# Altium project sound_bar.PrjPcb
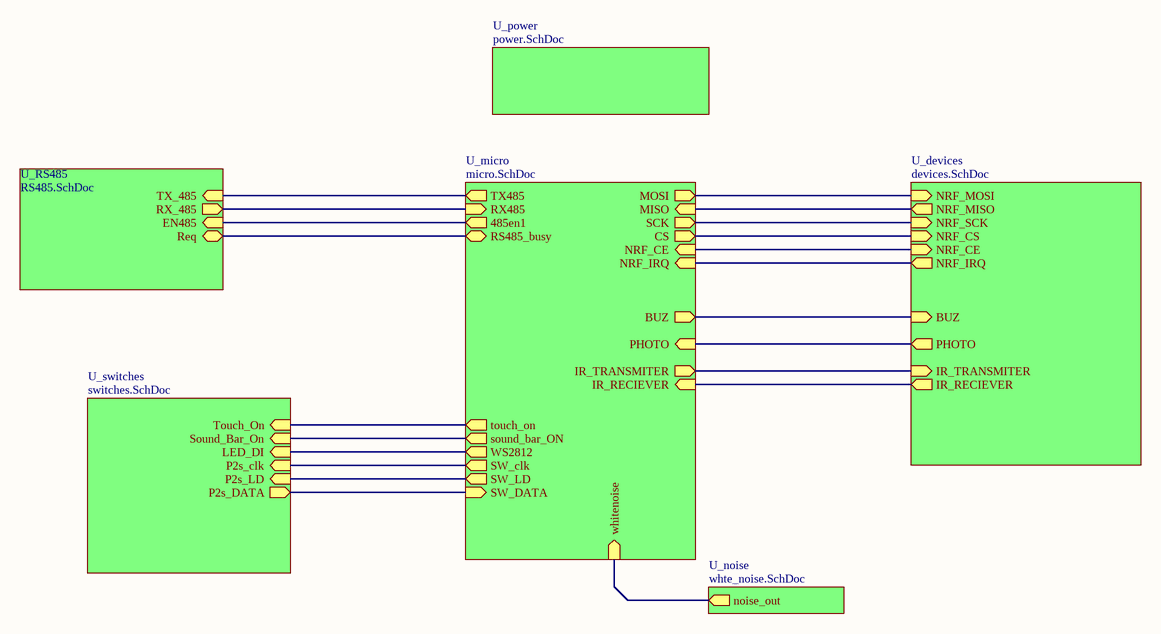
[diagram p0: top.SchDoc]
9 sheets, 289 parts. Net scope: hierarchical (ports join the sheet entries above them; power ports are global).
Board file: SOUNDBAR.PcbDoc
Sheets:
  top.SchDoc
    U_noise = whte_noise.SchDoc
    U_power = power.SchDoc
    U_RS485 = RS485.SchDoc
    U_switches = switches.SchDoc
      U_indicators = indicators.SchDoc
        L1 = led_pack12_touch.SchDoc
        L2 = led_pack12_touch.SchDoc
        L3 = led_pack12_touch.SchDoc
        L4 = led_pack12_touch.SchDoc
        L5 = led_pack12_touch.SchDoc
        L6 = led_pack12_touch.SchDoc
        L7 = led_pack12_touch.SchDoc
        L8 = led_pack12_touch.SchDoc
        L9 = led_pack12_touch.SchDoc
        L10 = led_pack12_touch.SchDoc
        L11 = led_pack12_touch.SchDoc
        L12 = led_pack12_touch.SchDoc
        L13 = led_pack12_touch.SchDoc
        L14 = led_pack12_touch.SchDoc
        L15 = led_pack12_touch.SchDoc
        L16 = led_pack12_touch.SchDoc
        L17 = led_pack12_touch.SchDoc
        L18 = led_pack12_touch.SchDoc
    U_micro = micro.SchDoc
    U_devices = devices.SchDoc

## Sheet top.SchDoc
size A4

### Sub-sheets
U_devices = devices.SchDoc: NRF_MISO (out), NRF_SCK (in), NRF_CE (in), NRF_IRQ (out), NRF_CS (in), NRF_MOSI (in), BUZ (in), PHOTO (out), IR_RECIEVER (out), IR_TRANSMITER (in)
U_micro = micro.SchDoc: whitenoise (in), RX485 (in), TX485 (out), 485en1 (out), RS485_busy (bidir), PHOTO (in), NRF_CE (in), WS2812 (out), NRF_IRQ (in), touch_on (out), IR_RECIEVER (in), IR_TRANSMITER (out), sound_bar_ON (out), MOSI (out), MISO (in), SCK (out), CS (out), BUZ (out), SW_DATA (in), SW_clk (out), SW_LD (out)
U_noise = whte_noise.SchDoc: noise_out (out)
U_power = power.SchDoc: no entries
U_RS485 = RS485.SchDoc: RX_485 (out), EN485 (in), TX_485 (in), Req (bidir)
U_switches = switches.SchDoc: P2s_clk (in), P2s_LD (in), P2s_DATA (out), LED_DI (in), Sound_Bar_On (in), Touch_On (in)

### Nets
485en: sheet U_RS485/EN485, sheet U_micro/485en1
CS: sheet U_micro/CS, sheet U_devices/NRF_CS
IR_IN: sheet U_micro/IR_RECIEVER, sheet U_devices/IR_RECIEVER
IR_OUT: sheet U_micro/IR_TRANSMITER, sheet U_devices/IR_TRANSMITER
MISO: sheet U_micro/MISO, sheet U_devices/NRF_MISO
MOSI: sheet U_micro/MOSI, sheet U_devices/NRF_MOSI
PACK12_DI2: sheet U_switches/LED_DI, sheet U_micro/WS2812
photo: sheet U_micro/PHOTO, sheet U_devices/PHOTO
RS48_busy: sheet U_RS485/Req, sheet U_micro/RS485_busy
RX485: sheet U_RS485/RX_485, sheet U_micro/RX485
SCK: sheet U_micro/SCK, sheet U_devices/NRF_SCK
SNB-ON: sheet U_switches/Sound_Bar_On, sheet U_micro/sound_bar_ON
SW_clk: sheet U_switches/P2s_clk, sheet U_micro/SW_clk
SW_DATA: sheet U_switches/P2s_DATA, sheet U_micro/SW_DATA
SW_LD: sheet U_switches/P2s_LD, sheet U_micro/SW_LD
TX485: sheet U_RS485/TX_485, sheet U_micro/TX485
whitenoise: sheet U_noise/noise_out, sheet U_micro/whitenoise
NetNRF1_3: sheet U_micro/NRF_CE, sheet U_devices/NRF_CE
NetNRF1_8: sheet U_micro/NRF_IRQ, sheet U_devices/NRF_IRQ
NetSP1_1: sheet U_micro/BUZ, sheet U_devices/BUZ
NetU1_27: sheet U_switches/Touch_On, sheet U_micro/touch_on

## Sheet whte_noise.SchDoc
size A4
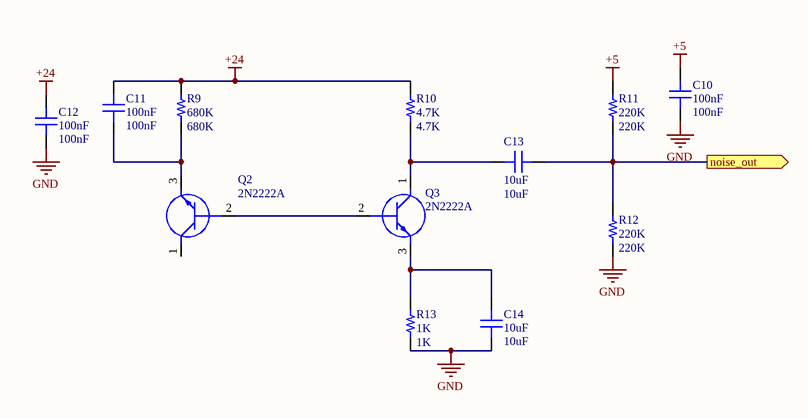
[diagram p1: whte_noise.SchDoc]

### Parts
C10  100nF  [cap805]
C11  100nF  [cap805]
C12  100nF  [cap805]
C13  10uF  [cap805]
C14  10uF  [cap805]
Q2  2N2222A  [soT95p280x130-3n]
Q3  2N2222A  [soT95p280x130-3n]
R9  680K  [0603R]
R10  4.7K  [0603R]
R11  220K  [0603R]
R12  220K  [0603R]
R13  1K  [0603R]

### Ports
noise_out (out)

### Nets
+5: C10.1 R11.2
+24: C11.2 C12.1 R9.2 R10.2
GND: C10.2 C12.2 C14.1 R12.1 R13.1
whitenoise: C13.1 R11.1 R12.2 ; port noise_out
NetC11_1: C11.1 Q2.3(E) R9.1
NetC13_2: C13.2 Q3.1(C) R10.1
NetC14_2: C14.2 Q3.3(E) R13.2
NetQ2_2: Q2.2(B) Q3.2(B)

Not connected (* = marked no-connect by the designer): Q2 1(C)

### Library data of the parts
C10-C14 = Capacitor: CAP SMD 0805; Part Number: C0805X106K9RAC7800
  C10-C12: Value: 100nF
  C13 C14: Value: 10uF
Q2 Q3 = 2N2222A: Transistor BJT NPN SMD; pin to pad: 1>3 2>1 3>2; Manufacturer_Name: Foshan Blue Rocket Elec; Datasheet Link: https://datasheet.lcsc.com/szlcsc/1901291437_Foshan-Blue-Rocket-Elec-2N2222A_C358533.pdf; Height: 4.7mm; Manufacturer_Part_Number: 2N2222A
R9-R13 = Resistor: RES SMD 0603; Part Number: RCS0805100KFKEA
  R9: Value: 680K
  R10: Value: 4.7K
  R11 R12: Value: 220K
  R13: Value: 1K

## Sheet power.SchDoc
size A4
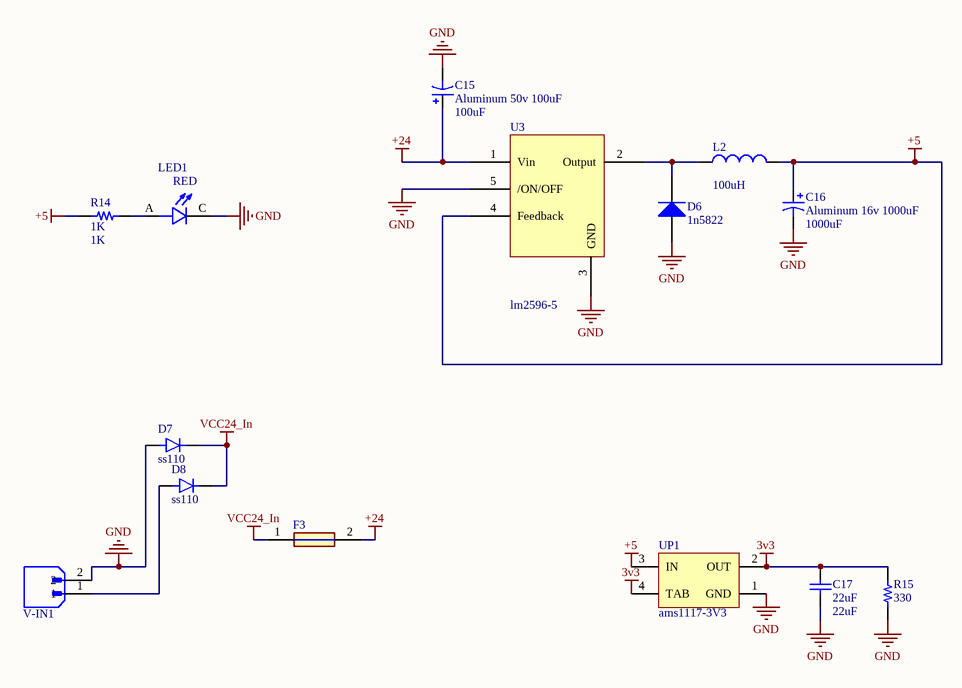
[diagram p2: power.SchDoc]

### Parts
C15  Aluminum 50v 100uF  value 100uF  [Cap SMD 100UF 35~50v]
C16  Aluminum 16v 1000uF  value 1000uF  [CAP SMD 1000UF 16V]
C17  22uF  [0603C]
D6  1n5822  [SMA DIODE 2]
D7  ss110  [ss110]
D8  ss110  [ss110]
F3  fuse 2amp  [1206 FUSE]  (value not drawn)
L2  value 100uH  [inductor]  (hidden comment: inductor 100uH)
LED1  LED RED  [LED_7012X1]  (value not drawn)
R14  1K  [0603R]
R15  330  [0603R]
U3  lm2596-5  [2596]
UP1  ams1117-3V3  [SOT223]
V-IN1  Phoenix  [AMPHENOL_OQ0271510000G]  (value not drawn)

### Nets
3v3: C17.2 R15.1 UP1.2(OUT) UP1.4(TAB)
+5: C16.1 L2.2 R14.1 U3.4(Feedback) UP1.3(IN)
+24: C15.1 F3.2 U3.1(Vin)
GND: C15.2 C16.2 C17.1 D6.1(A) D7.A LED1.C R15.2 U3.3(GND) U3.5(/ON/OFF) UP1.1(GND) V-IN1.2
VCC24_In: D7.C(K) D8.C(K) F3.1
NetD6_2: D6.2(K) L2.1 U3.2(Output)
NetD8_A: D8.A V-IN1.1
NetLED1_A: LED1.A R14.2

### Notes on the sheet
- (in symbol 7012X1) RED

### Library data of the parts
C15 C16 = Cap Pol1: CAP POLAR SMD; Published: 8-Jun-2000; LatestRevisionDate: 17-Jul-2002; LatestRevisionNote: Re-released for DXP Platform.; PackageReference: RB7.6-15; Publisher: Altium Limited; PackageDescription: Polarized Capacitor (Radial); 2 Leads
C17 = Cap: CAP SMD 0603; Published: 8-Jun-2000; LatestRevisionDate: 17-Jul-2002; LatestRevisionNote: Re-released for DXP Platform.; PackageReference: RAD-0.3; Publisher: Altium Limited; PackageDescription: Radial Cap, Thru-Hole; 2 Leads; 0.3 in Pin Spacing; Value: 22uF
D6 = Diode 1N4007: 1 Amp schottky Diode SMA; Published: 8-Jun-2000; LatestRevisionDate: 17-Jul-2002; LatestRevisionNote: Re-released for DXP Platform.; DatasheetVersion: 1998; PackageVersion: Aug-1999; PackageReference: DO-41; Publisher: Altium Limited; PackageDescription: Diode, Axial; Body 5.2 x 2.7 mm (LxDia. max), Lead Dia. 0.86 mm (max); Code_JEDEC: DO-204-AL; ComponentLink1Description: Manufacturer Link; ComponentLink1URL: http://www.fairchildsemi.com/; ComponentLink2Description: Datasheet; ComponentLink2URL: http://www.fairchildsemi.com/ds/1N%2F1N4001.pdf
D7 D8 = SBR0560S1-7: Diode Super Barrier 60V 500mA Surface Mount SOD-123; MF: Diodes Inc.; MP: SBR0560S1-7; Availability: Unavailable; SnapEDA_Link: https://www.snapeda.com/parts/SBR0560S1-7/Diodes%20Inc./view-part/491648/?ref=snap; Package: SOD-123 Diodes Inc.; Value: *; Price: None
F3 = 1206SFS200F_63-2: Fuse 1206; Manufacturer_Name: TE Connectivity; Manufacturer_Part_Number: 1206SFS200F/63-2; Datasheet Link: http://docs-emea.rs-online.com/webdocs/13b6/0900766b813b6e27.pdf; Height: 1.17mm
L2 = Inductor: Inductor 12*12mm; Code_IEC: 1005; Published: 8-Jun-2000; LatestRevisionDate: 29-May-2009; LatestRevisionNote: IPC-7351 Footprint Added.; PackageReference: 0402-A; Publisher: Altium Limited; PackageDescription: Chip Inductor; Code_JEITA: 0402
LED1 = 7012X1: LED SMD 0805 RED; Package: None; Price: None; Value: *; MP: 7012X1; Availability: Unavailable
R14 R15 = Resistor: as R9 on sheet whte_noise
  R14: Value: 1K
  R15: Value: 330
U3 = lm2596
UP1 = AMS1117-x.x: 3.3 Volt, 800mA SOT-223; Designer: Ali Hafizi; Data: 16-12-2016
V-IN1 = OQ0271510000G: Phoenix Terminal Right 2PIN; MF: Amphenol Anytek; MP: OQ0271510000G; Value: *; Check_prices: https://www.snapeda.com/parts/OQ0271510000G/Amphenol/view-part/4075971/?ref=eda; SnapEDA_Link: https://www.snapeda.com/parts/OQ0271510000G/Amphenol/view-part/4075971/?ref=snap; Price: None; Availability: Warning; Purchase-URL: https://pricing.snapeda.com/search/part/OQ0271510000G/?ref=eda; Package: None

## Sheet RS485.SchDoc
size A4
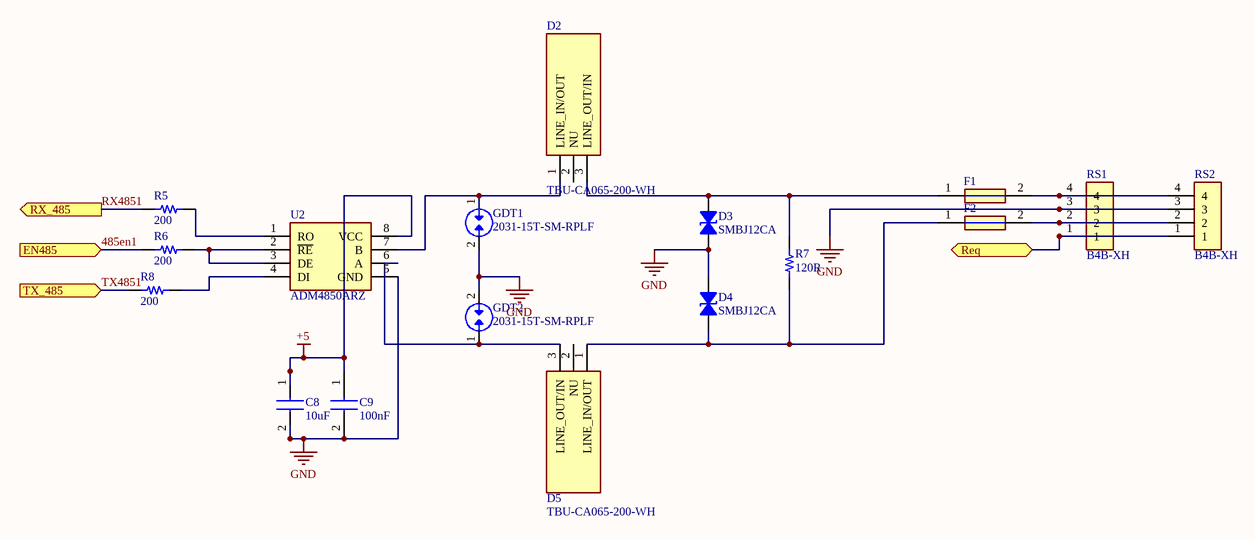
[diagram p3: RS485.SchDoc]

### Parts
C8  10uF  [Cap1206_(3216X15L)]
C9  100nF  [Cap1206_(3216X15L)]
D2  TBU-CA065-200-WH  [TBUCA025050WH]
D3  SMBJ12CA  [DO214AA SMB]
D4  SMBJ12CA  [DO214AA SMB]
D5  TBU-CA065-200-WH  [TBUCA025050WH]
F1  fuse 100mAmp  [1206 FUSE]  (value not drawn)
F2  fuse 100mAmp  [1206 FUSE]  (value not drawn)
GDT1  2031-15T-SM-RPLF  [TVS_2031-15T-SM-RPLF]
GDT2  2031-15T-SM-RPLF  [TVS_2031-15T-SM-RPLF]
R5  200  [0603R]
R6  200  [0603R]
R7  120R  [0603R]
R8  200  [0603R]
RS1  B4B-XH  [JST-B4B-XH]
RS2  B4B-XH  [JST-B4B-XH]
U2  ADM4850ARZ  [SO8_N]

### Ports
EN485 (in), Req (bidir), RX_485 (out), TX_485 (in)

### Nets
+5: C8.1 C9.1 U2.8(VCC)
GND: C8.2 C9.2 D3.1 D4.2 GDT1.2 GDT2.2 RS1.3 RS2.3 U2.5(GND)
485en1: R6.2 ; port EN485  [project net 485en]
RS48_busy: RS1.1 RS2.1 ; port Req
RX4851: R5.2 ; port RX_485  [project net RX485]
TX4851: R8.2 ; port TX_485  [project net TX485]
NetD2_1: D2.1(LINE_IN/OUT) GDT1.1 U2.7(B)
NetD2_3: D2.3(LINE_OUT/IN) D3.2 F1.1 R7.1
NetD4_1: D4.1 D5.1(LINE_IN/OUT) F2.1 R7.2
NetD5_3: D5.3(LINE_OUT/IN) GDT2.1 U2.6(A)
NetF1_2: F1.2 RS1.4 RS2.4
NetF2_2: F2.2 RS1.2 RS2.2
NetR5_1: R5.1 U2.1(RO)
NetR6_1: R6.1 U2.2(~{RE}) U2.3(DE)
NetR8_1: R8.1 U2.4(DI)

Not connected (* = marked no-connect by the designer): D2 2(NU); D5 2(NU)

### Library data of the parts
C8 C9 = C1206C104Z5UACTU: CAP SMD 0603; Manufacturer_Name: Kemet; Datasheet Link: https://componentsearchengine.com/Datasheets/1/C1206C104Z5UACTU.pdf; Height: 0.88mm; Manufacturer_Part_Number: C1206C104Z5UACTU; Mouser Part Number: 80-C1206C104Z5U; Mouser Price/Stock: https://www.mouser.com/Search/Refine.aspx?Keyword=80-C1206C104Z5U
D2 D5 = TBU-CA065-200-WH: TVS Diode (Bi-directional); Manufacturer_Name: Bourns; Datasheet Link: https://www.bourns.com/data/global/pdfs/TBU-CA.pdf; Height: 1mm; Manufacturer_Part_Number: TBU-CA065-200-WH; Mouser Part Number: 652-TBU-CA065-200-WH; Mouser Price/Stock: https://www.mouser.co.uk/ProductDetail/Bourns/TBU-CA065-200-WH?qs=kLtMOTa49OkdVs42fYbv8A%3D%3D; Arrow Part Number: TBU-CA065-200-WH; Arrow Price/Stock: https://www.arrow.com/en/products/tbu-ca065-200-wh/bourns?region=nac
D3 D4 = SMBJ12CA: TVS DIODE 12V 19.9V SMB; Manufacturer: AVX Corporation; Bidirectional Channels: 1; Current - Peak Pulse (10/1000µs): 30.15A; Power Line Protection: No; Power - Peak Pulse: 600W; Type: Zener; Voltage - Breakdown (Min): 13.3V; Part Number: SMBJ12CA; Applications: General Purpose; ComponentLink1Description: Datasheet; ComponentLink1URL: //media.digikey.com/pdf/Data%20Sheets/AVX%20PDFs/Transient%20Suppression%20Diodes.pdf; ComponentLink2Description: DigiKey Link; ComponentLink2URL: http://digikey.com/product-detail/en/avx-corporation/SMBJ12CA/478-7062-1-ND/3340353; LastUpdated: 9/2/2020 1:28:17 AM; Lifecycle Status: Active; Minimum Order: 1; Mounting Type: Surface Mount; Operating Temperature: -55°C ~ 150°C (TJ); Package / Case: DO-214AA, SMB; Packaging: TapeAndReel; PartId: 9012; Part Status: Active; Price: 0.16; Series: -; Supplier 1: DigiKey; Supplier Part Number 1: 478-7062-1-ND; Supplier Device Package: SMB; Voltage - Clamping (Max) @ Ipp: 19.9V; Voltage - Reverse Standoff (Typ): 12V
F1 F2 = 1206SFS200F_63-2: as F3 on sheet power; Datasheet Link: http://docs-emea.rs-online.com/webdocs/13b6/0900766b813b6e27.pdf; Height: 1.17mm
GDT1 GDT2 = 2031-15T-SM-RPLF: Gas Discharge Tube SMD; Package: None; Price: None; Value: *; MP: 2031-15T-SM-RPLF; Availability: Unavailable
R5-R8 = CRCW080510K0JNEAIF: RES SMD 0603; Manufacturer: Vishay Dale; Power (Watts): 0.125W, 1/8W; Resistance: 10 kOhms; Temperature Coefficient: ±200ppm/°C; Tolerance: ±5%; Part Number: CRCW080510K0JNEAIF; ComponentLink1Description: Datasheet; ComponentLink1URL: http://www.vishay.com/docs/20024/dcrcwife3.pdf; ComponentLink2Description: DigiKey Link; ComponentLink2URL: http://digikey.com/product-detail/en/vishay-dale/CRCW080510K0JNEAIF/541-10KAPCT-ND/3477322; Composition: Thick Film; Device Package: 0805 (2012 Metric); Features: Automotive AEC-Q200, Pulse Withstanding; Height - Seated (Max): 0.020" (0.50mm); LastUpdated: 9/2/2020 1:14:55 AM; Lifecycle Status: Active; Minimum Order: 1; Number of Terminations: 2; Operating Temperature: -55°C ~ 155°C; Package / Case: 0805 (2012 Metric); Packaging: TapeAndReel; PartId: 40891; Part Status: Active; Price: 0.08; Ratings: AEC-Q200; Series: CRCW-IF; Size / Dimension: 0.079" L x 0.049" W (2.00mm x 1.25mm); Supplier 1: DigiKey; Supplier Part Number 1: 541-10KAPCT-ND; Supplier Device Package: 0805
  R5 R6 R8: Value: 200
  R7: Value: 120R
RS1 RS2 = B4B-XH: XH 4pin standing
U2 = ADM4850ARZ: MAX485 SMD; Manufacturer_Name: Analog Devices; Datasheet Link: http://www.analog.com/static/imported-files/data_sheets/ADM4850_4851_4852_4853_4854_4855_4856_4857.pdf; Height: 1.75mm; Manufacturer_Part_Number: ADM4850ARZ; Mouser Part Number: 584-ADM4850ARZ; Mouser Price/Stock: https://www.mouser.com/Search/Refine.aspx?Keyword=584-ADM4850ARZ; Arrow Part Number: ADM4850ARZ; Arrow Price/Stock: https://www.arrow.com/en/products/adm4850arz/analog-devices

## Sheet switches.SchDoc
size A
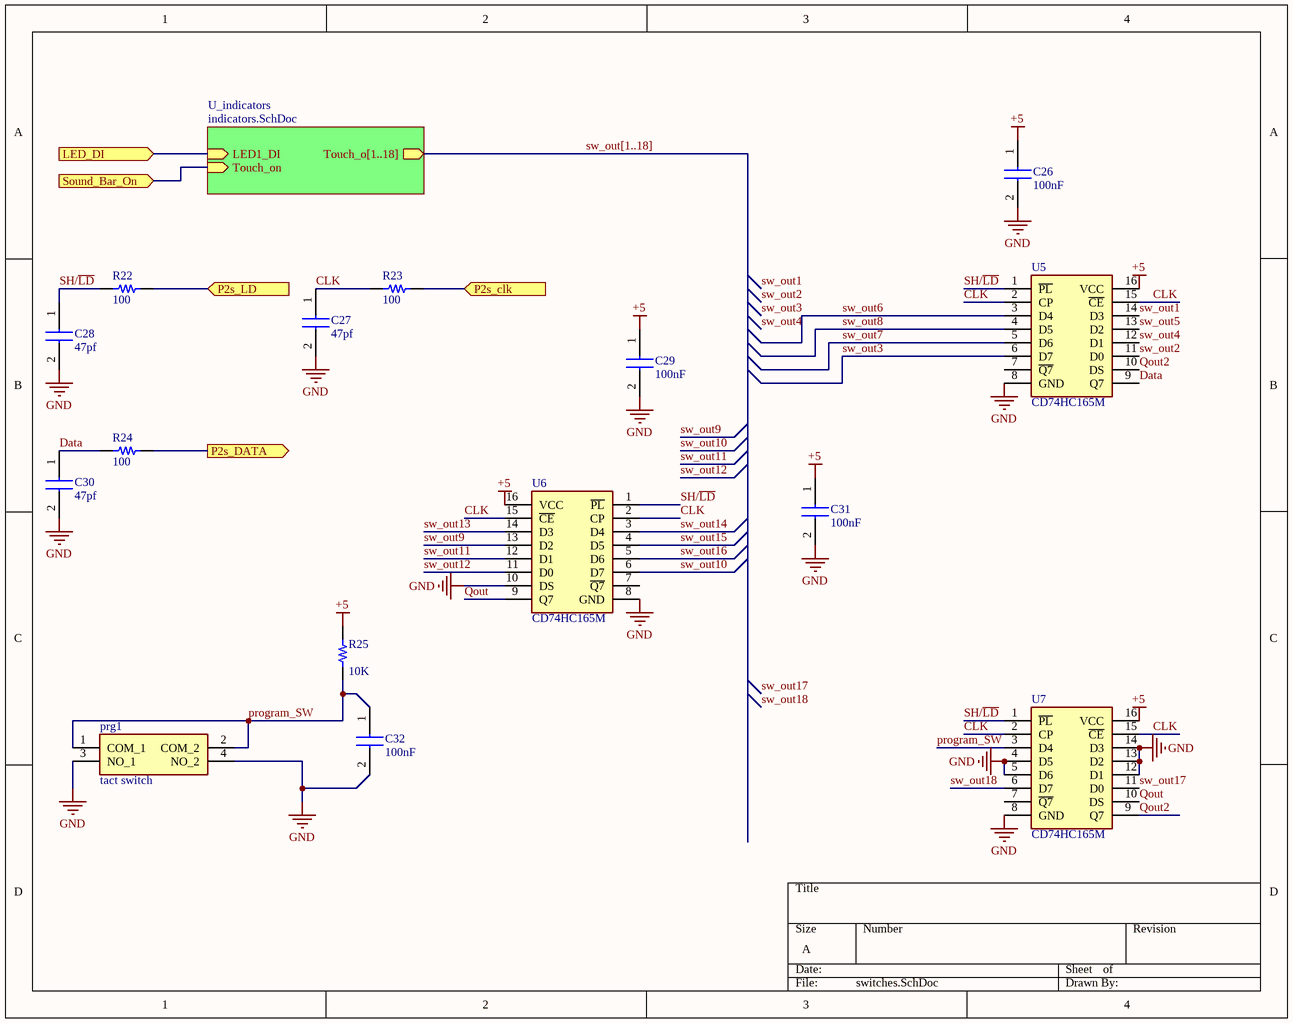
[diagram p4: switches.SchDoc]

### Parts
C26  100nF  [0603C]
C27  47pf  [0603C]
C28  47pf  [0603C]
C29  100nF  [0603C]
C30  47pf  [0603C]
C31  100nF  [0603C]
C32  100nF  [0603C]
prg1  tact switch  [DTSM63NVB]
R22  100  [0603R]
R23  100  [0603R]
R24  100  [RES1206 _(3216X08L)]
R25  10K  [0603R]
U5  CD74HC165M  [SOIC127P600X175-16N]
U6  CD74HC165M  [SOIC127P600X175-16N]
U7  CD74HC165M  [SOIC127P600X175-16N]

### Sub-sheets
U_indicators = indicators.SchDoc: LED1_DI (in), Touch_o[1..18] (out), Touch_on (in)

### Ports
LED_DI (in), P2s_clk (in), P2s_DATA (out), P2s_LD (in), Sound_Bar_On (in)

### Nets
+5: C26.1 C29.1 C31.1 R25.2 U5.16(VCC) U6.16(VCC) U7.16(VCC)
GND: C26.2 C27.2 C28.2 C29.2 C30.2 C31.2 C32.2 prg1.3(NO_1) prg1.4(NO_2) U5.8(GND) U6.8(GND) U6.10(DS) U7.4(D5) U7.5(D6) U7.8(GND) U7.12(D1) U7.13(D2) U7.14(D3)
CLK: C27.1 R23.2 U5.2(CP) U5.15(~{CE}) U6.2(CP) U6.15(~{CE}) U7.2(CP) U7.15(~{CE})
Data: C30.1 R24.2 U5.9(Q7)
PACK12_DI2: port LED_DI, sheet U_indicators/LED1_DI
program_SW: C32.1 prg1.1(COM_1) prg1.2(COM_2) R25.1 U7.3(D4)
Qout: U6.9(Q7) U7.10(DS)
Qout2: U5.10(DS) U7.9(Q7)
SH/~{LD}: C28.1 R22.2 U5.1(~{PL}) U6.1(~{PL}) U7.1(~{PL})
SNB-ON: port Sound_Bar_On, sheet U_indicators/Touch_on
SW_clk: R23.1 ; port P2s_clk
SW_DATA: R24.1 ; port P2s_DATA
SW_LD: R22.1 ; port P2s_LD
sw_out1: U5.14(D3)
sw_out2: U5.11(D0)
sw_out3: U5.6(D7)
sw_out4: U5.12(D1)
sw_out5: U5.13(D2)
sw_out6: U5.3(D4)
sw_out7: U5.5(D6)
sw_out8: U5.4(D5)
sw_out9: U6.13(D2)
sw_out10: U6.6(D7)
sw_out11: U6.12(D1)
sw_out12: U6.11(D0)
sw_out13: U6.14(D3)
sw_out14: U6.3(D4)
sw_out15: U6.4(D5)
sw_out16: U6.5(D6)
sw_out17: U7.11(D0)
sw_out18: U7.6(D7)

Not connected (* = marked no-connect by the designer): U5 7(~{Q7}); U6 7(~{Q7}); U7 7(~{Q7})

### Buses and harness runs
bus sw_out[1..18] = sheet U_indicators/Touch_o[1..18]

### Notes on the sheet
- Labels drawn without touching a wire or pin: sw_out1, sw_out2, sw_out3, sw_out4, sw_out17, sw_out18

### Library data of the parts
C26-C32 = C1206C104Z5UACTU: 100 nF Ceramic capacitor; Manufacturer_Name: Kemet; Datasheet Link: https://componentsearchengine.com/Datasheets/1/C1206C104Z5UACTU.pdf; Height: 0.88mm; Manufacturer_Part_Number: C1206C104Z5UACTU; Mouser Part Number: 80-C1206C104Z5U; Mouser Price/Stock: https://www.mouser.com/Search/Refine.aspx?Keyword=80-C1206C104Z5U
prg1 = DTSM-66R-V-T_R: Push Button SMD - 4PIN; Manufacturer_Name: Diptronics; Manufacturer_Part_Number: DTSM-66R-V-T/R; Datasheet Link: https://www.mouser.co.uk/datasheet/2/910/464_DTSMJ-6-1571536.pdf; Height: 7.1mm; Mouser Part Number: 113-DTSM66RVTR; Mouser Price/Stock: https://www.mouser.co.uk/ProductDetail/Diptronics/DTSM-66R-V-T-R?qs=MLItCLRbWsxl2%252BVY862AIw%3D%3D
R22-R24 = CRCW080510K0JNEAIF: RES SMD 10K OHM 5% 1/8W 0805; Manufacturer: Vishay Dale; Power (Watts): 0.125W, 1/8W; Resistance: 10 kOhms; Temperature Coefficient: ±200ppm/°C; Part Number: CRCW080510K0JNEAIF; Value: 100; ComponentLink1Description: Datasheet; ComponentLink1URL: http://www.vishay.com/docs/20024/dcrcwife3.pdf; ComponentLink2Description: DigiKey Link; ComponentLink2URL: http://digikey.com/product-detail/en/vishay-dale/CRCW080510K0JNEAIF/541-10KAPCT-ND/3477322; Composition: Thick Film; Device Package: 0805 (2012 Metric); Features: Automotive AEC-Q200, Pulse Withstanding; Height - Seated (Max): 0.020" (0.50mm); LastUpdated: 9/2/2020 1:14:55 AM; Lifecycle Status: Active; Minimum Order: 1; Number of Terminations: 2; Operating Temperature: -55°C ~ 155°C; Package / Case: 0805 (2012 Metric); Packaging: TapeAndReel; PartId: 40891; Part Status: Active; Price: 0.08; Ratings: AEC-Q200; Series: CRCW-IF; Size / Dimension: 0.079" L x 0.049" W (2.00mm x 1.25mm); Supplier 1: DigiKey; Supplier Part Number 1: 541-10KAPCT-ND; Supplier Device Package: 0805; Tolerance: ±5%
R25 = Resistor: as R9 on sheet whte_noise; Value: 10K
U5-U7 = CD74HC165M: Integrated Circuit; Manufacturer_Name: Texas Instruments; Datasheet Link: http://www.ti.com/lit/ds/symlink/cd74hc165.pdf; Height: 1.75mm; Manufacturer_Part_Number: CD74HC165M; Mouser Part Number: 595-CD74HC165M; Mouser Price/Stock: https://www.mouser.co.uk/ProductDetail/Texas-Instruments/CD74HC165M?qs=EIjG%252BN7kn%252BnD8dKZ7mdfJA%3D%3D; Arrow Part Number: CD74HC165M; Arrow Price/Stock: https://www.arrow.com/en/products/cd74hc165m/texas-instruments?region=nac

## Sheet indicators.SchDoc
size A4
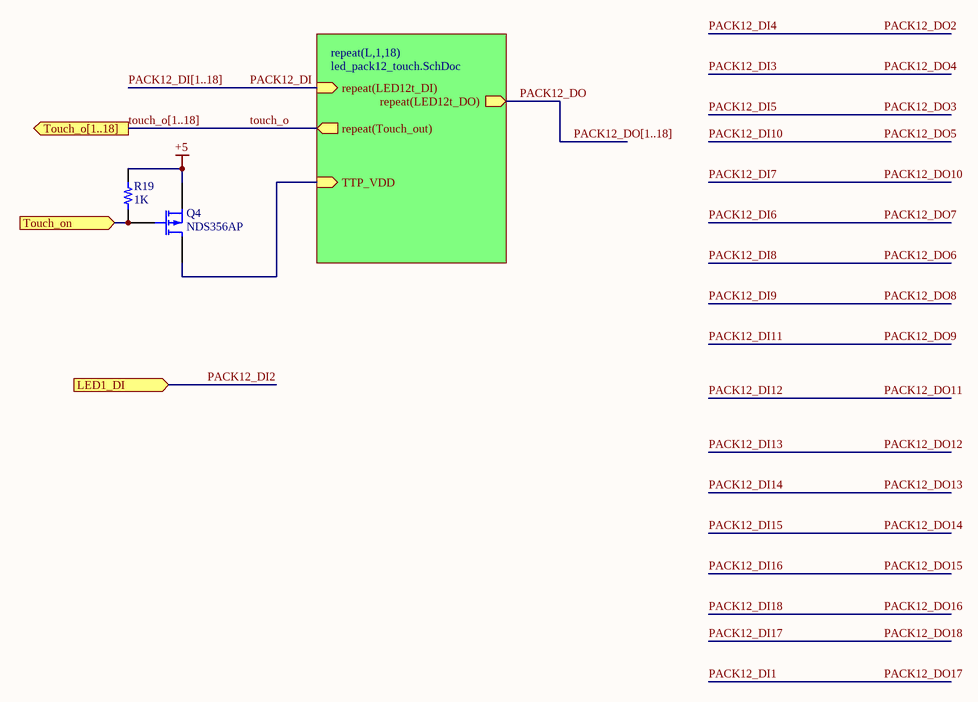
[diagram p5: indicators.SchDoc]

### Parts
Q4  NDS356AP  [soT95p280x130-3n]
R19  1K  [0603R]

### Sub-sheets
repeat(L,1,18) = led_pack12_touch.SchDoc: TTP_VDD (in), repeat(Touch_out) (out), repeat(LED12t_DO) (out), repeat(LED12t_DI) (in)

### Ports
LED1_DI (in), Touch_o[1..18] (out), Touch_on (in)

### Nets
+5: Q4.3(S) R19.1
PACK12_DI: sheet repeat(L,1,18)/repeat(LED12t_DI)
PACK12_DO: sheet repeat(L,1,18)/repeat(LED12t_DO)
SNB-ON: Q4.2(G) R19.2 ; port Touch_on
touch_o: sheet repeat(L,1,18)/repeat(Touch_out)
TTP_VDD: Q4.1(D) ; sheet repeat(L,1,18)/TTP_VDD

### Buses and harness runs
bus PACK12_DI[1..18]
bus PACK12_DO[1..18]
bus touch_o[1..18] = port Touch_o[1..18]

### Library data of the parts
Q4 = MOSFET-P: P-Channel MOSFET SOT23; pin to pad: 1>3 2>1 3>2; Published: 8-Jun-2000; LatestRevisionDate: 17-Jul-2002; LatestRevisionNote: Re-released for DXP Platform.; PackageVersion: 1995/1996; PackageReference: E3; Publisher: Altium Limited; PackageDescription: TO, Flat Index; 3 In-Line, Axial Leads; Body Dia. 4.6mm; Lead Dia. 0.5 mm (max)
R19 = Resistor: as R9 on sheet whte_noise; Value: 1K

## Sheet led_pack12_touch.SchDoc
size A4
Used 18 times, as channels U_switches/U_indicators/L1, U_switches/U_indicators/L2, U_switches/U_indicators/L3, U_switches/U_indicators/L4, U_switches/U_indicators/L5, U_switches/U_indicators/L6, U_switches/U_indicators/L7, U_switches/U_indicators/L8, U_switches/U_indicators/L9, U_switches/U_indicators/L10, U_switches/U_indicators/L11, U_switches/U_indicators/L12, U_switches/U_indicators/L13, U_switches/U_indicators/L14, U_switches/U_indicators/L15, U_switches/U_indicators/L16, U_switches/U_indicators/L17, U_switches/U_indicators/L18. Parts and nets are listed once, with the designators drawn on the sheet.
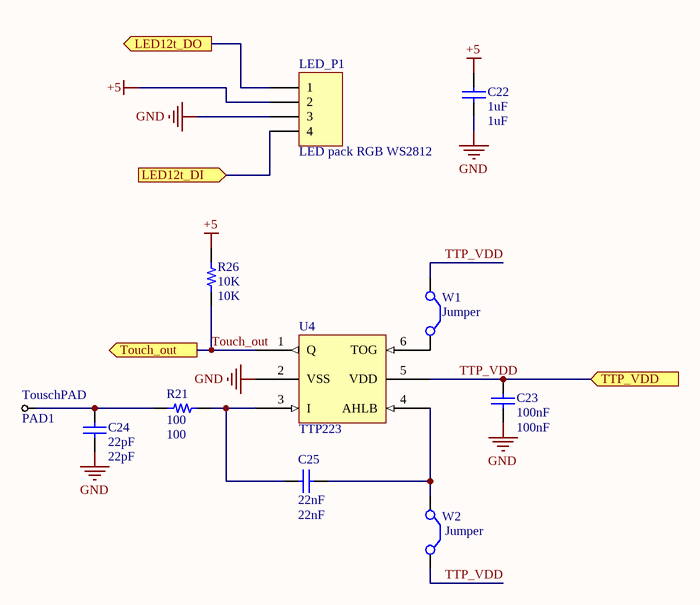
[diagram p6: led_pack12_touch.SchDoc]

### Parts
C22  1uF  [0603C]
C23  100nF  [0603C]
C24  22pF  [0603C]
C25  22nF  [0603C]
LED_P1  LED pack RGB WS2812  [PACK124-2121-2]
PAD1  TouschPAD  [touchpad6]  (no BOM)
R21  100  [0603R]
R26  10K  [0603R]
U4  TTP223  [SOT23-6_L]
W1  Jumper  [JUMPER]  (no BOM)
W2  Jumper  [JUMPER]  (no BOM)

### Ports
LED12t_DI (in), LED12t_DO (out), Touch_out (out), TTP_VDD (in)

### Nets
+5: C22.2 LED_P1.2 R26.1
GND: C22.1 C23.1 C24.1 LED_P1.3 U4.2(VSS)
LED12t_DI: LED_P1.4 ; port LED12t_DI
LED12t_DO: LED_P1.1 ; port LED12t_DO
Touch_out: R26.2 U4.1(Q) ; port Touch_out
TTP_VDD: C23.2 U4.5(VDD) W1.1(C1) W2.2(C2) ; port TTP_VDD
NetC24_2: C24.2 PAD1.1(T) R21.2
NetC25_1: C25.1 U4.4(AHLB) W2.1(C1)
NetC25_2: C25.2 R21.1 U4.3(I)
NetU4_6: U4.6(TOG) W1.2(C2)

### Channels
U_switches/U_indicators/L1: designators end in _L1; ports LED12t_DI=PACK12_DI1 LED12t_DO=PACK12_DO1 Touch_out=sw_out1 TTP_VDD=TTP_VDD
U_switches/U_indicators/L2: designators end in _L2; ports LED12t_DI=PACK12_DI2 LED12t_DO=PACK12_DI4 Touch_out=sw_out2 TTP_VDD=TTP_VDD
U_switches/U_indicators/L3: designators end in _L3; ports LED12t_DI=PACK12_DI3 LED12t_DO=PACK12_DI5 Touch_out=sw_out3 TTP_VDD=TTP_VDD
U_switches/U_indicators/L4: designators end in _L4; ports LED12t_DI=PACK12_DI4 LED12t_DO=PACK12_DI3 Touch_out=sw_out4 TTP_VDD=TTP_VDD
U_switches/U_indicators/L5: designators end in _L5; ports LED12t_DI=PACK12_DI5 LED12t_DO=PACK12_DI10 Touch_out=sw_out5 TTP_VDD=TTP_VDD
U_switches/U_indicators/L6: designators end in _L6; ports LED12t_DI=PACK12_DI6 LED12t_DO=PACK12_DI8 Touch_out=sw_out6 TTP_VDD=TTP_VDD
U_switches/U_indicators/L7: designators end in _L7; ports LED12t_DI=PACK12_DI7 LED12t_DO=PACK12_DI6 Touch_out=sw_out7 TTP_VDD=TTP_VDD
U_switches/U_indicators/L8: designators end in _L8; ports LED12t_DI=PACK12_DI8 LED12t_DO=PACK12_DI9 Touch_out=sw_out8 TTP_VDD=TTP_VDD
U_switches/U_indicators/L9: designators end in _L9; ports LED12t_DI=PACK12_DI9 LED12t_DO=PACK12_DI11 Touch_out=sw_out9 TTP_VDD=TTP_VDD
U_switches/U_indicators/L10: designators end in _L10; ports LED12t_DI=PACK12_DI10 LED12t_DO=PACK12_DI7 Touch_out=sw_out10 TTP_VDD=TTP_VDD
U_switches/U_indicators/L11: designators end in _L11; ports LED12t_DI=PACK12_DI11 LED12t_DO=PACK12_DI12 Touch_out=sw_out11 TTP_VDD=TTP_VDD
U_switches/U_indicators/L12: designators end in _L12; ports LED12t_DI=PACK12_DI12 LED12t_DO=PACK12_DI13 Touch_out=sw_out12 TTP_VDD=TTP_VDD
U_switches/U_indicators/L13: designators end in _L13; ports LED12t_DI=PACK12_DI13 LED12t_DO=PACK12_DI14 Touch_out=sw_out13 TTP_VDD=TTP_VDD
U_switches/U_indicators/L14: designators end in _L14; ports LED12t_DI=PACK12_DI14 LED12t_DO=PACK12_DI15 Touch_out=sw_out14 TTP_VDD=TTP_VDD
U_switches/U_indicators/L15: designators end in _L15; ports LED12t_DI=PACK12_DI15 LED12t_DO=PACK12_DI16 Touch_out=sw_out15 TTP_VDD=TTP_VDD
U_switches/U_indicators/L16: designators end in _L16; ports LED12t_DI=PACK12_DI16 LED12t_DO=PACK12_DI18 Touch_out=sw_out16 TTP_VDD=TTP_VDD
U_switches/U_indicators/L17: designators end in _L17; ports LED12t_DI=PACK12_DI17 LED12t_DO=PACK12_DI1 Touch_out=sw_out17 TTP_VDD=TTP_VDD
U_switches/U_indicators/L18: designators end in _L18; ports LED12t_DI=PACK12_DI18 LED12t_DO=PACK12_DI17 Touch_out=sw_out18 TTP_VDD=TTP_VDD

### Library data of the parts
C22 C23 = Cap: CAP SMD 0603; Published: 8-Jun-2000; LatestRevisionDate: 17-Jul-2002; LatestRevisionNote: Re-released for DXP Platform.; PackageReference: RAD-0.3; Publisher: Altium Limited; PackageDescription: Radial Cap, Thru-Hole; 2 Leads; 0.3 in Pin Spacing
  C22: Value: 1uF
  C23: Value: 100nF
C24 C25 = Cap: X7R_NPO; Published: 8-Jun-2000; LatestRevisionDate: 17-Jul-2002; LatestRevisionNote: Re-released for DXP Platform.; PackageReference: RAD-0.3; Publisher: Altium Limited; PackageDescription: Radial Cap, Thru-Hole; 2 Leads; 0.3 in Pin Spacing
  C24: Value: 22pF
  C25: Value: 22nF
LED_P1 = Header 4: 8 32mm RGB LED pack; LatestRevisionDate: 17-Jul-2002; LatestRevisionNote: Re-released for DXP Platform.; Publisher: Altium Limited
PAD1 = Test Point
R21 R26 = Resistor: as R9 on sheet whte_noise
  R21: Value: 100
  R26: Value: 10K
U4 = ttp223b: capacitive touch IC
W1 W2 = Jumper: Jumper Wire; Published: 24-Mar-1999; LatestRevisionDate: 17-Jul-2002; LatestRevisionNote: Re-released for DXP Platform.; PackageReference: RAD-0.2; Publisher: Altium Limited; PackageDescription: Radial Cap, Thru-Hole; 2 Leads; 0.2 in Pin Spacing

## Sheet micro.SchDoc
size A3
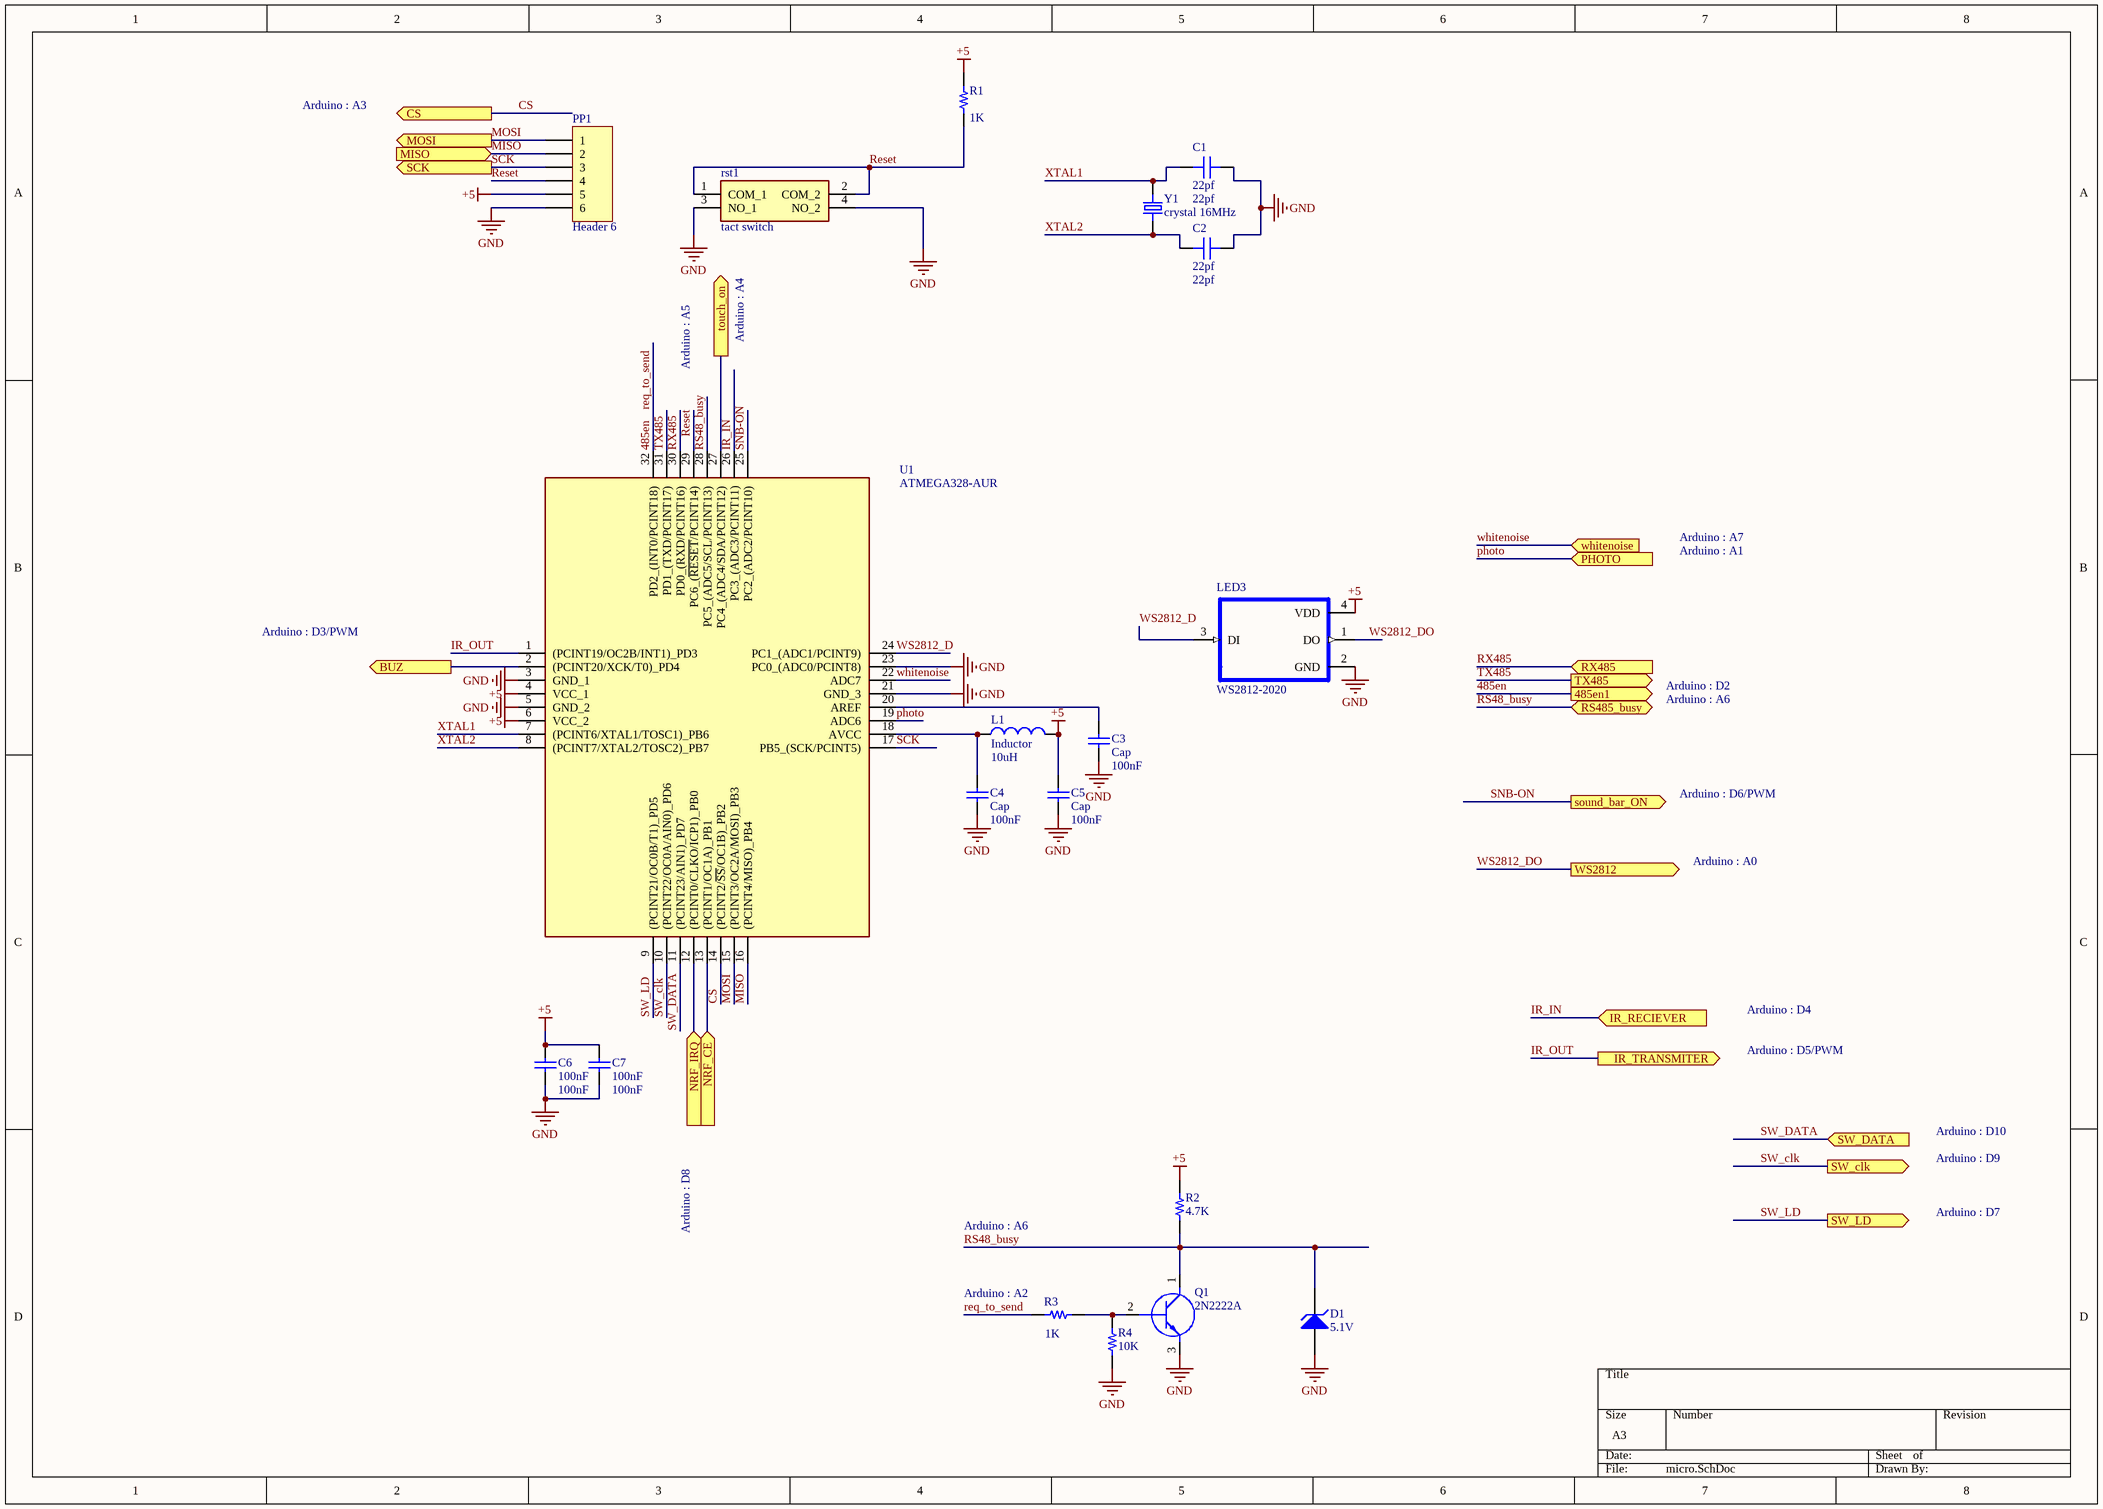
[diagram p7: micro.SchDoc]

### Parts
C1  22pf  [0603C]
C2  22pf  [0603C]
C3  Cap  value 100nF  [0603C]
C4  Cap  value 100nF  [0603C]
C5  Cap  value 100nF  [0603C]
C6  100nF  [0603C]
C7  100nF  [0603C]
D1  5.1V  [Diode 1n4148 SMD]
L1  Inductor  value 10uH  [IND1206]
LED3  WS2812-2020  [LED_WS2812-2020]
PP1  Header 6  [HDR1X6]
Q1  2N2222A  [soT95p280x130-3n]
R1  1K  [0603R]
R2  4.7K  [0603R]
R3  1K  [0603R]
R4  10K  [0603R]
rst1  tact switch  [DTSM63NVB]
U1  ATMEGA328-AUR  [TQFP32_N]
Y1  crystal 16MHz  [XTAL_ECS-180-S-5P-DN-TR]

### Ports
485en1 (out), BUZ (out), CS (out), IR_RECIEVER (in), IR_TRANSMITER (out), MISO (in), MOSI (out), NRF_CE (in), NRF_IRQ (in), PHOTO (in), RS485_busy (bidir), RX485 (in), SCK (out), sound_bar_ON (out), SW_clk (out), SW_DATA (in), SW_LD (out), touch_on (out), TX485 (out), whitenoise (in), WS2812 (out)

### Nets
+5: C5.1 C6.1 C7.1 L1.2 LED3.4(VDD) PP1.5 R1.2 R2.1 U1.4(VCC_1) U1.6(VCC_2)
GND: C1.1 C2.1 C3.2 C4.2 C5.2 C6.2 C7.2 D1.1(A) LED3.2(GND) PP1.6 Q1.3(E) R4.2 rst1.3(NO_1) rst1.4(NO_2) U1.3(GND_1) U1.5(GND_2) U1.21(GND_3) U1.23(PC0_(ADC0/PCINT8))
485en: R3.2 U1.32(PD2_(INT0/PCINT18)) ; port 485en1  [also labelled req_to_send]
CS: U1.14((PCINT2/~{SS}/OC1B)_PB2) ; port CS
IR_IN: U1.26(PC3_(ADC3/PCINT11)) ; port IR_RECIEVER
IR_OUT: U1.1((PCINT19/OC2B/INT1)_PD3) ; port IR_TRANSMITER
MISO: PP1.2 U1.16((PCINT4/MISO)_PB4) ; port MISO
MOSI: PP1.1 U1.15((PCINT3/OC2A/MOSI)_PB3) ; port MOSI
photo: U1.19(ADC6) ; port PHOTO
Reset: PP1.4 R1.1 rst1.1(COM_1) rst1.2(COM_2) U1.29(PC6_(~{RESET}/PCINT14))
RS48_busy: D1.2(K) Q1.1(C) R2.2 U1.28(PC5_(ADC5/SCL/PCINT13)) ; port RS485_busy
RX485: U1.30(PD0_(RXD/PCINT16)) ; port RX485
SCK: PP1.3 U1.17(PB5_(SCK/PCINT5)) ; port SCK
SNB-ON: U1.25(PC2_(ADC2/PCINT10)) ; port sound_bar_ON
SW_clk: U1.10((PCINT22/OC0A/AIN0)_PD6) ; port SW_clk
SW_DATA: U1.11((PCINT23/AIN1)_PD7) ; port SW_DATA
SW_LD: U1.9((PCINT21/OC0B/T1)_PD5) ; port SW_LD
TX485: U1.31(PD1_(TXD/PCINT17)) ; port TX485
whitenoise: U1.22(ADC7) ; port whitenoise
WS2812_D: LED3.3(DI) U1.24(PC1_(ADC1/PCINT9))
WS2812_DO: LED3.1(DO) ; port WS2812  [project net PACK12_DI2]
XTAL1: C1.2 U1.7((PCINT6/XTAL1/TOSC1)_PB6) Y1.2
XTAL2: C2.2 U1.8((PCINT7/XTAL2/TOSC2)_PB7) Y1.1
NetC3_1: C3.1 U1.20(AREF)
NetC4_1: C4.1 L1.1 U1.18(AVCC)
NetNRF1_3: U1.13((PCINT1/OC1A)_PB1) ; port NRF_CE
NetNRF1_8: U1.12((PCINT0/CLKO/ICP1)_PB0) ; port NRF_IRQ
NetQ1_2: Q1.2(B) R3.1 R4.1
NetSP1_1: U1.2((PCINT20/XCK/T0)_PD4) ; port BUZ
NetU1_27: U1.27(PC4_(ADC4/SDA/PCINT12)) ; port touch_on

### Notes on the sheet
- Arduino : A3
- Arduino : A5
- Arduino : A4
- Arduino : A1
- Arduino : A7
- Arduino : D3/PWM
- Arduino : D2
- Arduino : A6
- Arduino : D6/PWM
- Arduino : A0
- Arduino : D5/PWM
- Arduino : D4
- Arduino : D10
- Arduino : D9
- Arduino : D8
- Arduino : D7
- (near R3) Arduino : A2

### Library data of the parts
C1 C2 = Capacitor: CAP SMD 0603; Part Number: C0805X106K9RAC7800; Value: 22pf
C3-C5 = Cap: Capacitor; Published: 8-Jun-2000; LatestRevisionDate: 17-Jul-2002; LatestRevisionNote: Re-released for DXP Platform.; PackageReference: RAD-0.3; Publisher: Altium Limited; PackageDescription: Radial Cap, Thru-Hole; 2 Leads; 0.3 in Pin Spacing
C6 C7 = Cap: CAP SMD 0603; Published: 8-Jun-2000; LatestRevisionDate: 17-Jul-2002; LatestRevisionNote: Re-released for DXP Platform.; PackageReference: RAD-0.3; Publisher: Altium Limited; PackageDescription: Radial Cap, Thru-Hole; 2 Leads; 0.3 in Pin Spacing; Value: 100nF
D1 = D Zener: Zener Diode 5.1v; Published: 8-Jun-2000; LatestRevisionDate: 17-Jul-2002; LatestRevisionNote: Re-released for DXP Platform.; PackageReference: DIODE-0.7; Publisher: Altium Limited; PackageDescription: Diode, Thru-Hole; 2 Leads; 0.7 in Pin Spacing
L1 = Inductor: Code_IEC: 1005; Published: 8-Jun-2000; LatestRevisionDate: 29-May-2009; LatestRevisionNote: IPC-7351 Footprint Added.; PackageReference: 0402-A; Publisher: Altium Limited; PackageDescription: Chip Inductor; Code_JEITA: 0402
LED3 = WS2812-2020: Intelligent control LED integrated light source; MF: Worldsemi; SnapEDA_Link: https://www.snapeda.com/parts/WS2812-2020/Worldsemi/view-part/2873751/?ref=snap; Package: Package Analog Devices; MP: WS2812-2020; Value: *; Availability: Unavailable; Price: None
PP1 = Header 6: Header, 6-Pin , female; LatestRevisionDate: 17-Jul-2002; LatestRevisionNote: Re-released for DXP Platform.; Publisher: Altium Limited
Q1 = 2N2222A: Transistor BJT NPN SMD; pin to pad: 1>3 2>1 3>2; Manufacturer_Name: Foshan Blue Rocket Elec; Datasheet Link: https://datasheet.lcsc.com/szlcsc/1901291437_Foshan-Blue-Rocket-Elec-2N2222A_C358533.pdf; Height: 4.7mm; Manufacturer_Part_Number: 2N2222A
R1-R4 = Resistor: as R9 on sheet whte_noise
  R1 R3: Value: 1K
  R2: Value: 4.7K
  R4: Value: 10K
rst1 = DTSM-66R-V-T_R: as prg1 on sheet switches; Datasheet Link: https://www.mouser.co.uk/datasheet/2/910/464_DTSMJ-6-1571536.pdf; Height: 7.1mm; Mouser Part Number: 113-DTSM66RVTR; Mouser Price/Stock: https://www.mouser.co.uk/ProductDetail/Diptronics/DTSM-66R-V-T-R?qs=MLItCLRbWsxl2%252BVY862AIw%3D%3D
U1 = ATMEGA328-AUR: Integrated Circuit; Manufacturer_Name: Microchip; Datasheet Link: https://componentsearchengine.com/Datasheets/1/ATMEGA328-AUR.pdf; Height: 1.2mm; Manufacturer_Part_Number: ATMEGA328-AUR; Mouser Part Number: 556-ATMEGA328-AUR; Mouser Price/Stock: https://www.mouser.co.uk/ProductDetail/Microchip-Technology-Atmel/ATMEGA328-AUR?qs=lwdSMh1%2FoYLfe%252B5OKFEFrw%3D%3D; Arrow Part Number: ATMEGA328-AUR; Arrow Price/Stock: https://www.arrow.com/en/products/atmega328-aur/microchip-technology
Y1 = ECS-180-S-5P-DN-TR: Crystals 16MHz; MF: ECS International; MP: ECS-180-S-5P-DN-TR; Value: 16MHz; SnapEDA_Link: https://www.snapeda.com/parts/ECS-180-S-5P-DN-TR/ECS%20International/view-part/2547669/?ref=snap; Price: None; Package: HC49/US ECS International; Availability: Unavailable

## Sheet devices.SchDoc
size A3
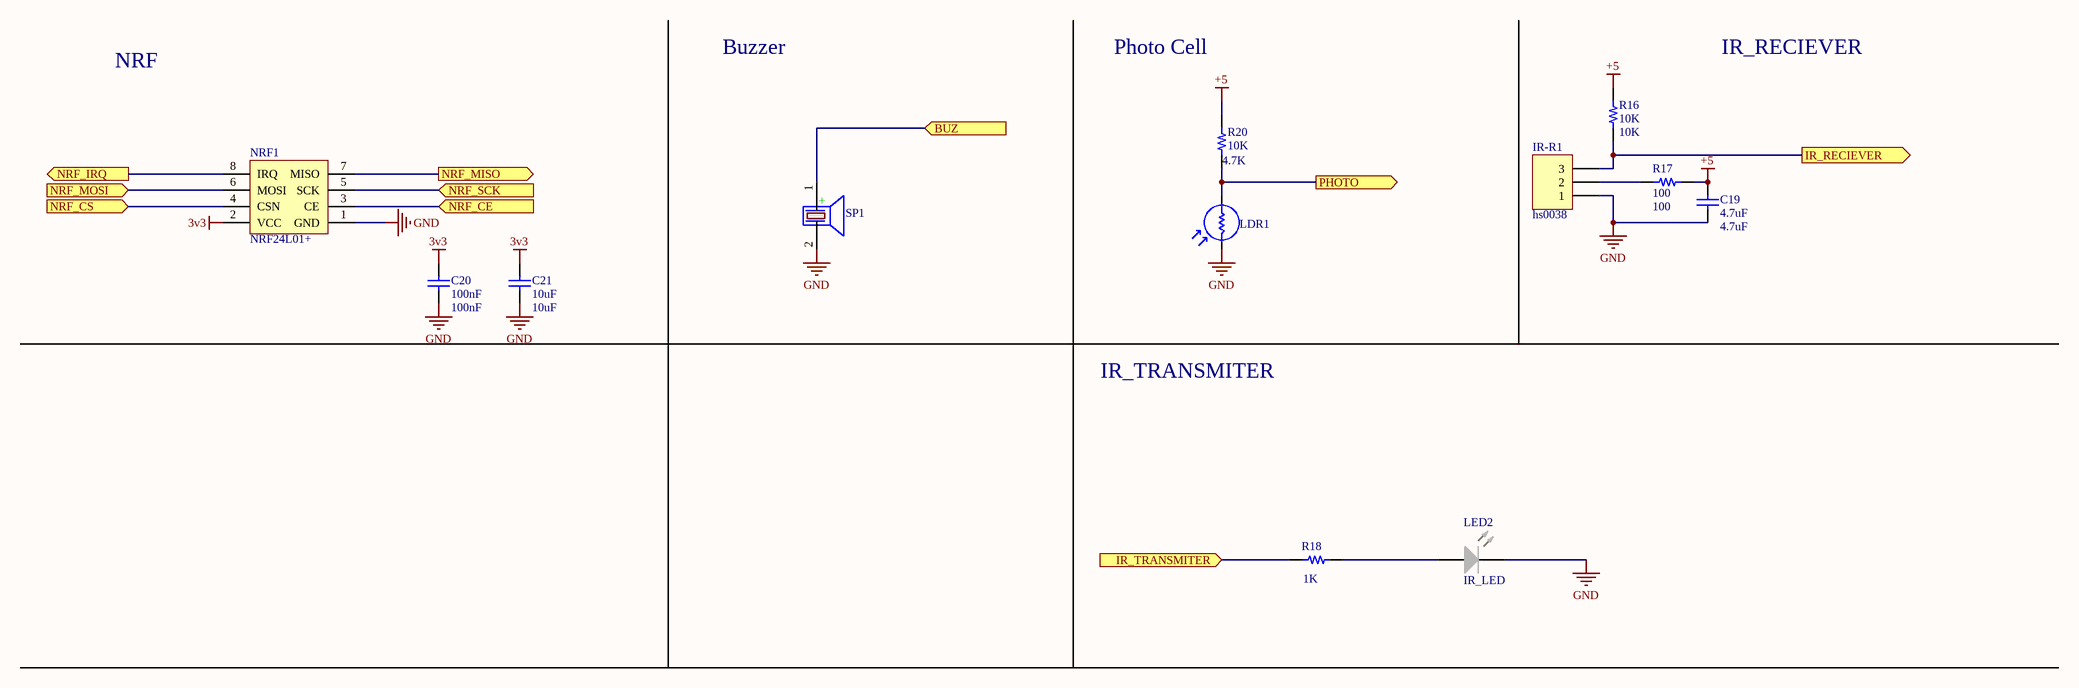
[diagram p8: devices.SchDoc]

### Parts
C19  4.7uF  [0603C]
C20  100nF  [0603C]
C21  10uF  [0603C]
IR-R1  hs0038  [HS3800B]
LDR1  PhotoCell-5mm  [PhotoCell]  (value not drawn)
LED2  IR_LED  [LED_WHITE]
NRF1  NRF24L01+  [NRF24L01P]
R16  10K  [0603R]
R17  100  [0603R]
R18  1K  [0603R]
R20  10K  value 4.7K  [0603R]
SP1  BUZZER  [BUZZER 7.62mm DC]  (value not drawn)

### Ports
BUZ (in), IR_RECIEVER (out), IR_TRANSMITER (in), NRF_CE (in), NRF_CS (in), NRF_IRQ (out), NRF_MISO (out), NRF_MOSI (in), NRF_SCK (in), PHOTO (out)

### Nets
3v3: C20.2 C21.2 NRF1.2(VCC)
+5: C19.2 R16.1 R17.1 R20.1
GND: C19.1 C20.1 C21.1 IR-R1.1 LDR1.1 LED2.K NRF1.1(GND) SP1.2(-)
CS: NRF1.4(CSN) ; port NRF_CS
IR_IN: IR-R1.3 R16.2 ; port IR_RECIEVER
IR_OUT: R18.2 ; port IR_TRANSMITER
MISO: NRF1.7(MISO) ; port NRF_MISO
MOSI: NRF1.6(MOSI) ; port NRF_MOSI
photo: LDR1.2 R20.2 ; port PHOTO
SCK: NRF1.5(SCK) ; port NRF_SCK
NetIR-R1_2: IR-R1.2 R17.2
NetLED2_A: LED2.A R18.1
NetNRF1_3: NRF1.3(CE) ; port NRF_CE
NetNRF1_8: NRF1.8(IRQ) ; port NRF_IRQ
NetSP1_1: SP1.1(+) ; port BUZ

### Notes on the sheet
- NRF
- Buzzer
- Photo Cell
- IR_RECIEVER
- IR_TRANSMITER

### Library data of the parts
C19-C21 = Cap: CAP SMD 0603; Published: 8-Jun-2000; LatestRevisionDate: 17-Jul-2002; LatestRevisionNote: Re-released for DXP Platform.; PackageReference: RAD-0.3; Publisher: Altium Limited; PackageDescription: Radial Cap, Thru-Hole; 2 Leads; 0.3 in Pin Spacing
  C19: Value: 4.7uF
  C20: Value: 100nF
  C21: Value: 10uF
IR-R1 = Header 3H: Header, 3-Pin, Right Angle; LatestRevisionDate: 17-Jul-2002; LatestRevisionNote: Re-released for DXP Platform.; Publisher: Altium Limited
LDR1 = LDR: Photo Cell- Variable Resistor With Light; Company: IPA CO.; Designer: Saeid Jorablo; Last Update Time: 2008/07/17
LED2 = LED-W
NRF1 = NRF24L01P: NRF Module; Ali Hafizi: Creature
R16-R18 R20 = Resistor: as R9 on sheet whte_noise
  R16: Value: 10K
  R17: Value: 100
  R18: Value: 1K
SP1 = PIEZO BUZZER: PIEZO BUZZER 5VOLTS; Designer: Abbas Basereh; Comment_1: SPEAKER AND BEEP; Design Date: 1395/11/14; ComponentLink2Description: Reference; PackageDescription: THD; Publisher: Abbas Basereh; Mounting Technology: THD; Pin Count: 2; Status: Unreleased

## Nets that join several sheets
3v3: power (C17.2 R15.1 UP1.2 UP1.4), devices (C20.2 C21.2 NRF1.2)
+5: whte_noise (C10.1 R11.2), power (5 pins), RS485 (C8.1 C9.1 U2.8), switches (7 pins), indicators (Q4.3 R19.1), U_switches/U_indicators/L1 (C22_L1.2 LED_P1_L1.2 R26_L1.1), U_switches/U_indicators/L2 (C22_L2.2 LED_P1_L2.2 R26_L2.1), U_switches/U_indicators/L3 (C22_L3.2 LED_P1_L3.2 R26_L3.1), U_switches/U_indicators/L4 (C22_L4.2 LED_P1_L4.2 R26_L4.1), U_switches/U_indicators/L5 (C22_L5.2 LED_P1_L5.2 R26_L5.1), U_switches/U_indicators/L6 (C22_L6.2 LED_P1_L6.2 R26_L6.1), U_switches/U_indicators/L7 (C22_L7.2 LED_P1_L7.2 R26_L7.1), U_switches/U_indicators/L8 (C22_L8.2 LED_P1_L8.2 R26_L8.1), U_switches/U_indicators/L9 (C22_L9.2 LED_P1_L9.2 R26_L9.1), U_switches/U_indicators/L10 (C22_L10.2 LED_P1_L10.2 R26_L10.1), U_switches/U_indicators/L11 (C22_L11.2 LED_P1_L11.2 R26_L11.1), U_switches/U_indicators/L12 (C22_L12.2 LED_P1_L12.2 R26_L12.1), U_switches/U_indicators/L13 (C22_L13.2 LED_P1_L13.2 R26_L13.1), U_switches/U_indicators/L14 (C22_L14.2 LED_P1_L14.2 R26_L14.1), U_switches/U_indicators/L15 (C22_L15.2 LED_P1_L15.2 R26_L15.1), U_switches/U_indicators/L16 (C22_L16.2 LED_P1_L16.2 R26_L16.1), U_switches/U_indicators/L17 (C22_L17.2 LED_P1_L17.2 R26_L17.1), U_switches/U_indicators/L18 (C22_L18.2 LED_P1_L18.2 R26_L18.1), micro (10 pins), devices (C19.2 R16.1 R17.1 R20.1)
+24: whte_noise (C11.2 C12.1 R9.2 R10.2), power (C15.1 F3.2 U3.1)
GND: whte_noise (5 pins), power (11 pins), RS485 (9 pins), switches (18 pins), U_switches/U_indicators/L1 (5 pins), U_switches/U_indicators/L2 (5 pins), U_switches/U_indicators/L3 (5 pins), U_switches/U_indicators/L4 (5 pins), U_switches/U_indicators/L5 (5 pins), U_switches/U_indicators/L6 (5 pins), U_switches/U_indicators/L7 (5 pins), U_switches/U_indicators/L8 (5 pins), U_switches/U_indicators/L9 (5 pins), U_switches/U_indicators/L10 (5 pins), U_switches/U_indicators/L11 (5 pins), U_switches/U_indicators/L12 (5 pins), U_switches/U_indicators/L13 (5 pins), U_switches/U_indicators/L14 (5 pins), U_switches/U_indicators/L15 (5 pins), U_switches/U_indicators/L16 (5 pins), U_switches/U_indicators/L17 (5 pins), U_switches/U_indicators/L18 (5 pins), micro (18 pins), devices (8 pins)
485en: RS485 (R6.2), micro (R3.2 U1.32)
CS: micro (U1.14), devices (NRF1.4)
IR_IN: micro (U1.26), devices (IR-R1.3 R16.2)
IR_OUT: micro (U1.1), devices (R18.2)
MISO: micro (PP1.2 U1.16), devices (NRF1.7)
MOSI: micro (PP1.1 U1.15), devices (NRF1.6)
NetNRF1_3: micro (U1.13), devices (NRF1.3)
NetNRF1_8: micro (U1.12), devices (NRF1.8)
NetSP1_1: micro (U1.2), devices (SP1.1)
PACK12_DI1: U_switches/U_indicators/L1 (LED_P1_L1.4), U_switches/U_indicators/L17 (LED_P1_L17.1)
PACK12_DI2: U_switches/U_indicators/L2 (LED_P1_L2.4), micro (LED3.1)
PACK12_DI3: U_switches/U_indicators/L3 (LED_P1_L3.4), U_switches/U_indicators/L4 (LED_P1_L4.1)
PACK12_DI4: U_switches/U_indicators/L2 (LED_P1_L2.1), U_switches/U_indicators/L4 (LED_P1_L4.4)
PACK12_DI5: U_switches/U_indicators/L3 (LED_P1_L3.1), U_switches/U_indicators/L5 (LED_P1_L5.4)
PACK12_DI6: U_switches/U_indicators/L6 (LED_P1_L6.4), U_switches/U_indicators/L7 (LED_P1_L7.1)
PACK12_DI7: U_switches/U_indicators/L7 (LED_P1_L7.4), U_switches/U_indicators/L10 (LED_P1_L10.1)
PACK12_DI8: U_switches/U_indicators/L6 (LED_P1_L6.1), U_switches/U_indicators/L8 (LED_P1_L8.4)
PACK12_DI9: U_switches/U_indicators/L8 (LED_P1_L8.1), U_switches/U_indicators/L9 (LED_P1_L9.4)
PACK12_DI10: U_switches/U_indicators/L5 (LED_P1_L5.1), U_switches/U_indicators/L10 (LED_P1_L10.4)
PACK12_DI11: U_switches/U_indicators/L9 (LED_P1_L9.1), U_switches/U_indicators/L11 (LED_P1_L11.4)
PACK12_DI12: U_switches/U_indicators/L11 (LED_P1_L11.1), U_switches/U_indicators/L12 (LED_P1_L12.4)
PACK12_DI13: U_switches/U_indicators/L12 (LED_P1_L12.1), U_switches/U_indicators/L13 (LED_P1_L13.4)
PACK12_DI14: U_switches/U_indicators/L13 (LED_P1_L13.1), U_switches/U_indicators/L14 (LED_P1_L14.4)
PACK12_DI15: U_switches/U_indicators/L14 (LED_P1_L14.1), U_switches/U_indicators/L15 (LED_P1_L15.4)
PACK12_DI16: U_switches/U_indicators/L15 (LED_P1_L15.1), U_switches/U_indicators/L16 (LED_P1_L16.4)
PACK12_DI17: U_switches/U_indicators/L17 (LED_P1_L17.4), U_switches/U_indicators/L18 (LED_P1_L18.1)
PACK12_DI18: U_switches/U_indicators/L16 (LED_P1_L16.1), U_switches/U_indicators/L18 (LED_P1_L18.4)
photo: micro (U1.19), devices (LDR1.2 R20.2)
RS48_busy: RS485 (RS1.1 RS2.1), micro (D1.2 Q1.1 R2.2 U1.28)
RX485: RS485 (R5.2), micro (U1.30)
SCK: micro (PP1.3 U1.17), devices (NRF1.5)
SNB-ON: indicators (Q4.2 R19.2), micro (U1.25)
SW_clk: switches (R23.1), micro (U1.10)
SW_DATA: switches (R24.1), micro (U1.11)
SW_LD: switches (R22.1), micro (U1.9)
sw_out1: switches (U5.14), U_switches/U_indicators/L1 (R26_L1.2 U4_L1.1)
sw_out2: switches (U5.11), U_switches/U_indicators/L2 (R26_L2.2 U4_L2.1)
sw_out3: switches (U5.6), U_switches/U_indicators/L3 (R26_L3.2 U4_L3.1)
sw_out4: switches (U5.12), U_switches/U_indicators/L4 (R26_L4.2 U4_L4.1)
sw_out5: switches (U5.13), U_switches/U_indicators/L5 (R26_L5.2 U4_L5.1)
sw_out6: switches (U5.3), U_switches/U_indicators/L6 (R26_L6.2 U4_L6.1)
sw_out7: switches (U5.5), U_switches/U_indicators/L7 (R26_L7.2 U4_L7.1)
sw_out8: switches (U5.4), U_switches/U_indicators/L8 (R26_L8.2 U4_L8.1)
sw_out9: switches (U6.13), U_switches/U_indicators/L9 (R26_L9.2 U4_L9.1)
sw_out10: switches (U6.6), U_switches/U_indicators/L10 (R26_L10.2 U4_L10.1)
sw_out11: switches (U6.12), U_switches/U_indicators/L11 (R26_L11.2 U4_L11.1)
sw_out12: switches (U6.11), U_switches/U_indicators/L12 (R26_L12.2 U4_L12.1)
sw_out13: switches (U6.14), U_switches/U_indicators/L13 (R26_L13.2 U4_L13.1)
sw_out14: switches (U6.3), U_switches/U_indicators/L14 (R26_L14.2 U4_L14.1)
sw_out15: switches (U6.4), U_switches/U_indicators/L15 (R26_L15.2 U4_L15.1)
sw_out16: switches (U6.5), U_switches/U_indicators/L16 (R26_L16.2 U4_L16.1)
sw_out17: switches (U7.11), U_switches/U_indicators/L17 (R26_L17.2 U4_L17.1)
sw_out18: switches (U7.6), U_switches/U_indicators/L18 (R26_L18.2 U4_L18.1)
TTP_VDD: indicators (Q4.1), U_switches/U_indicators/L1 (C23_L1.2 U4_L1.5 W1_L1.1 W2_L1.2), U_switches/U_indicators/L2 (C23_L2.2 U4_L2.5 W1_L2.1 W2_L2.2), U_switches/U_indicators/L3 (C23_L3.2 U4_L3.5 W1_L3.1 W2_L3.2), U_switches/U_indicators/L4 (C23_L4.2 U4_L4.5 W1_L4.1 W2_L4.2), U_switches/U_indicators/L5 (C23_L5.2 U4_L5.5 W1_L5.1 W2_L5.2), U_switches/U_indicators/L6 (C23_L6.2 U4_L6.5 W1_L6.1 W2_L6.2), U_switches/U_indicators/L7 (C23_L7.2 U4_L7.5 W1_L7.1 W2_L7.2), U_switches/U_indicators/L8 (C23_L8.2 U4_L8.5 W1_L8.1 W2_L8.2), U_switches/U_indicators/L9 (C23_L9.2 U4_L9.5 W1_L9.1 W2_L9.2), U_switches/U_indicators/L10 (C23_L10.2 U4_L10.5 W1_L10.1 W2_L10.2), U_switches/U_indicators/L11 (C23_L11.2 U4_L11.5 W1_L11.1 W2_L11.2), U_switches/U_indicators/L12 (C23_L12.2 U4_L12.5 W1_L12.1 W2_L12.2), U_switches/U_indicators/L13 (C23_L13.2 U4_L13.5 W1_L13.1 W2_L13.2), U_switches/U_indicators/L14 (C23_L14.2 U4_L14.5 W1_L14.1 W2_L14.2), U_switches/U_indicators/L15 (C23_L15.2 U4_L15.5 W1_L15.1 W2_L15.2), U_switches/U_indicators/L16 (C23_L16.2 U4_L16.5 W1_L16.1 W2_L16.2), U_switches/U_indicators/L17 (C23_L17.2 U4_L17.5 W1_L17.1 W2_L17.2), U_switches/U_indicators/L18 (C23_L18.2 U4_L18.5 W1_L18.1 W2_L18.2)
TX485: RS485 (R8.2), micro (U1.31)
whitenoise: whte_noise (C13.1 R11.1 R12.2), micro (U1.22)